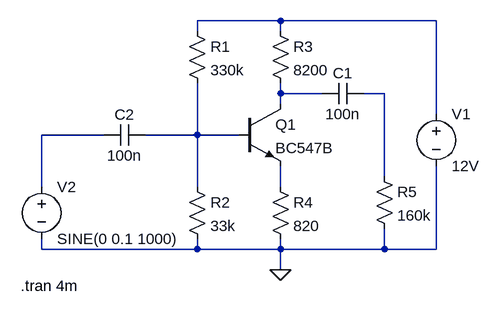
[diagram p0: schematic MajchrowskiMateusz.asc]
MajchrowskiMateusz.asc, the LTspice schematic file:
Version 4
SHEET 1 1308 680
WIRE 192 -16 64 -16
WIRE 432 -16 192 -16
WIRE 64 0 64 -16
WIRE 192 0 192 -16
WIRE 192 96 192 80
WIRE 256 96 192 96
WIRE 352 96 320 96
WIRE 192 112 192 96
WIRE 432 128 432 -16
WIRE -80 160 -176 160
WIRE 64 160 64 80
WIRE 64 160 -16 160
WIRE 128 160 64 160
WIRE 352 224 352 96
WIRE -176 240 -176 160
WIRE 64 240 64 160
WIRE 192 240 192 208
WIRE -176 336 -176 320
WIRE 64 336 64 320
WIRE 64 336 -176 336
WIRE 192 336 192 320
WIRE 192 336 64 336
WIRE 352 336 352 304
WIRE 352 336 192 336
WIRE 432 336 432 208
WIRE 432 336 352 336
WIRE 192 368 192 336
FLAG 192 368 0
SYMBOL voltage 432 112 R0
WINDOW 123 0 0 Left 2
WINDOW 39 0 0 Left 2
SYMATTR InstName V1
SYMATTR Value 12V
SYMBOL npn 128 112 R0
SYMATTR InstName Q1
SYMATTR Value BC547B
SYMBOL res 176 -16 R0
SYMATTR InstName R3
SYMATTR Value 8200
SYMBOL res 176 224 R0
SYMATTR InstName R4
SYMATTR Value 820
SYMBOL res 48 224 R0
SYMATTR InstName R2
SYMATTR Value 33k
SYMBOL res 48 -16 R0
SYMATTR InstName R1
SYMATTR Value 330k
SYMBOL cap 320 80 R90
WINDOW 0 0 32 VBottom 2
WINDOW 3 32 32 VTop 2
SYMATTR InstName C1
SYMATTR Value 100n
SYMBOL cap -16 144 R90
WINDOW 0 0 32 VBottom 2
WINDOW 3 32 32 VTop 2
SYMATTR InstName C2
SYMATTR Value 100n
SYMBOL res 336 208 R0
SYMATTR InstName R5
SYMATTR Value 160k
SYMBOL voltage -176 224 R0
WINDOW 123 0 0 Left 2
WINDOW 39 0 0 Left 2
SYMATTR InstName V2
SYMATTR Value SINE(0 0.1 1000)
TEXT -208 392 Left 2 !.tran 4m

The netlist it stands for:
* MajchrowskiMateusz.asc
V1 N001 0 12V
Q1 N002 N005 N006 0 BC547B
R3 N001 N002 8200
R4 N006 0 820
R2 N005 0 33k
R1 N001 N005 330k
C1 N003 N002 100n
C2 N005 N004 100n
R5 N003 0 160k
V2 N004 0 SINE(0 0.1 1000)
.model NPN NPN
.model PNP PNP
.lib standard.bjt
.tran 4m
.backanno
.end